# Altium project my_first_project.PrjPcb (part 1 of 3)
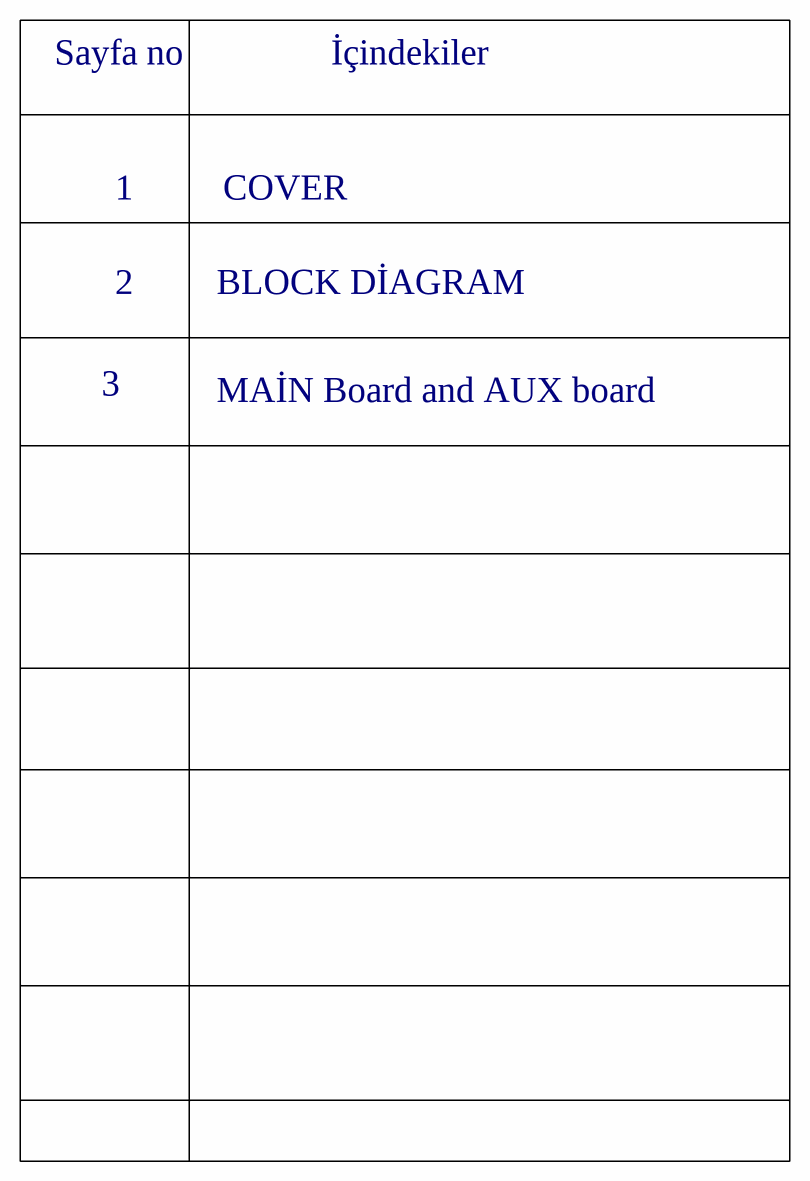
[diagram p0: project_cover.SchDoc]
5 sheets, 127 parts. Net scope: global (net labels, ports and power ports of the same name join across sheets).
Board file: myfirst_project.PcbDoc
Sheets:
  project_cover.SchDoc
  Block_Diagram.SchDoc
  SensorBoard.SchDoc
  Microcontroller.SchDoc
  POWER_Manegement.SchDoc

## Sheet project_cover.SchDoc
size A3; Engineer: Alperen ÖZKUL; DocumentNumber: 1; SheetNumber: 1; SheetTotal: 5; FIRST_PROJECT: *FIRST_PROJECT; PAGE_SİZE: *A3

### Notes on the sheet
- Sayfa no
- İçindekiler
- 1
- COVER
- 2
- BLOCK DİAGRAM
- 3
- MAİN Board and AUX board
- Engineer
- PROJECT_NUMBER
- SIZE
- TITLE
- UNIVERSITY
- DATE:
- SHEET=
- OF

## Sheet Block_Diagram.SchDoc: WİRELESS SECURİTY DETECTOR
size A3; Date: 1/10/2023; CompanyName: ZONGULDAK BÜLENT ECEVİT; Engineer: Alperen ÖZKUL; DocumentNumber: 2; SheetNumber: 2; SheetTotal: 5; FIRST_PROJECT: 1; PAGE_SİZE: *A3
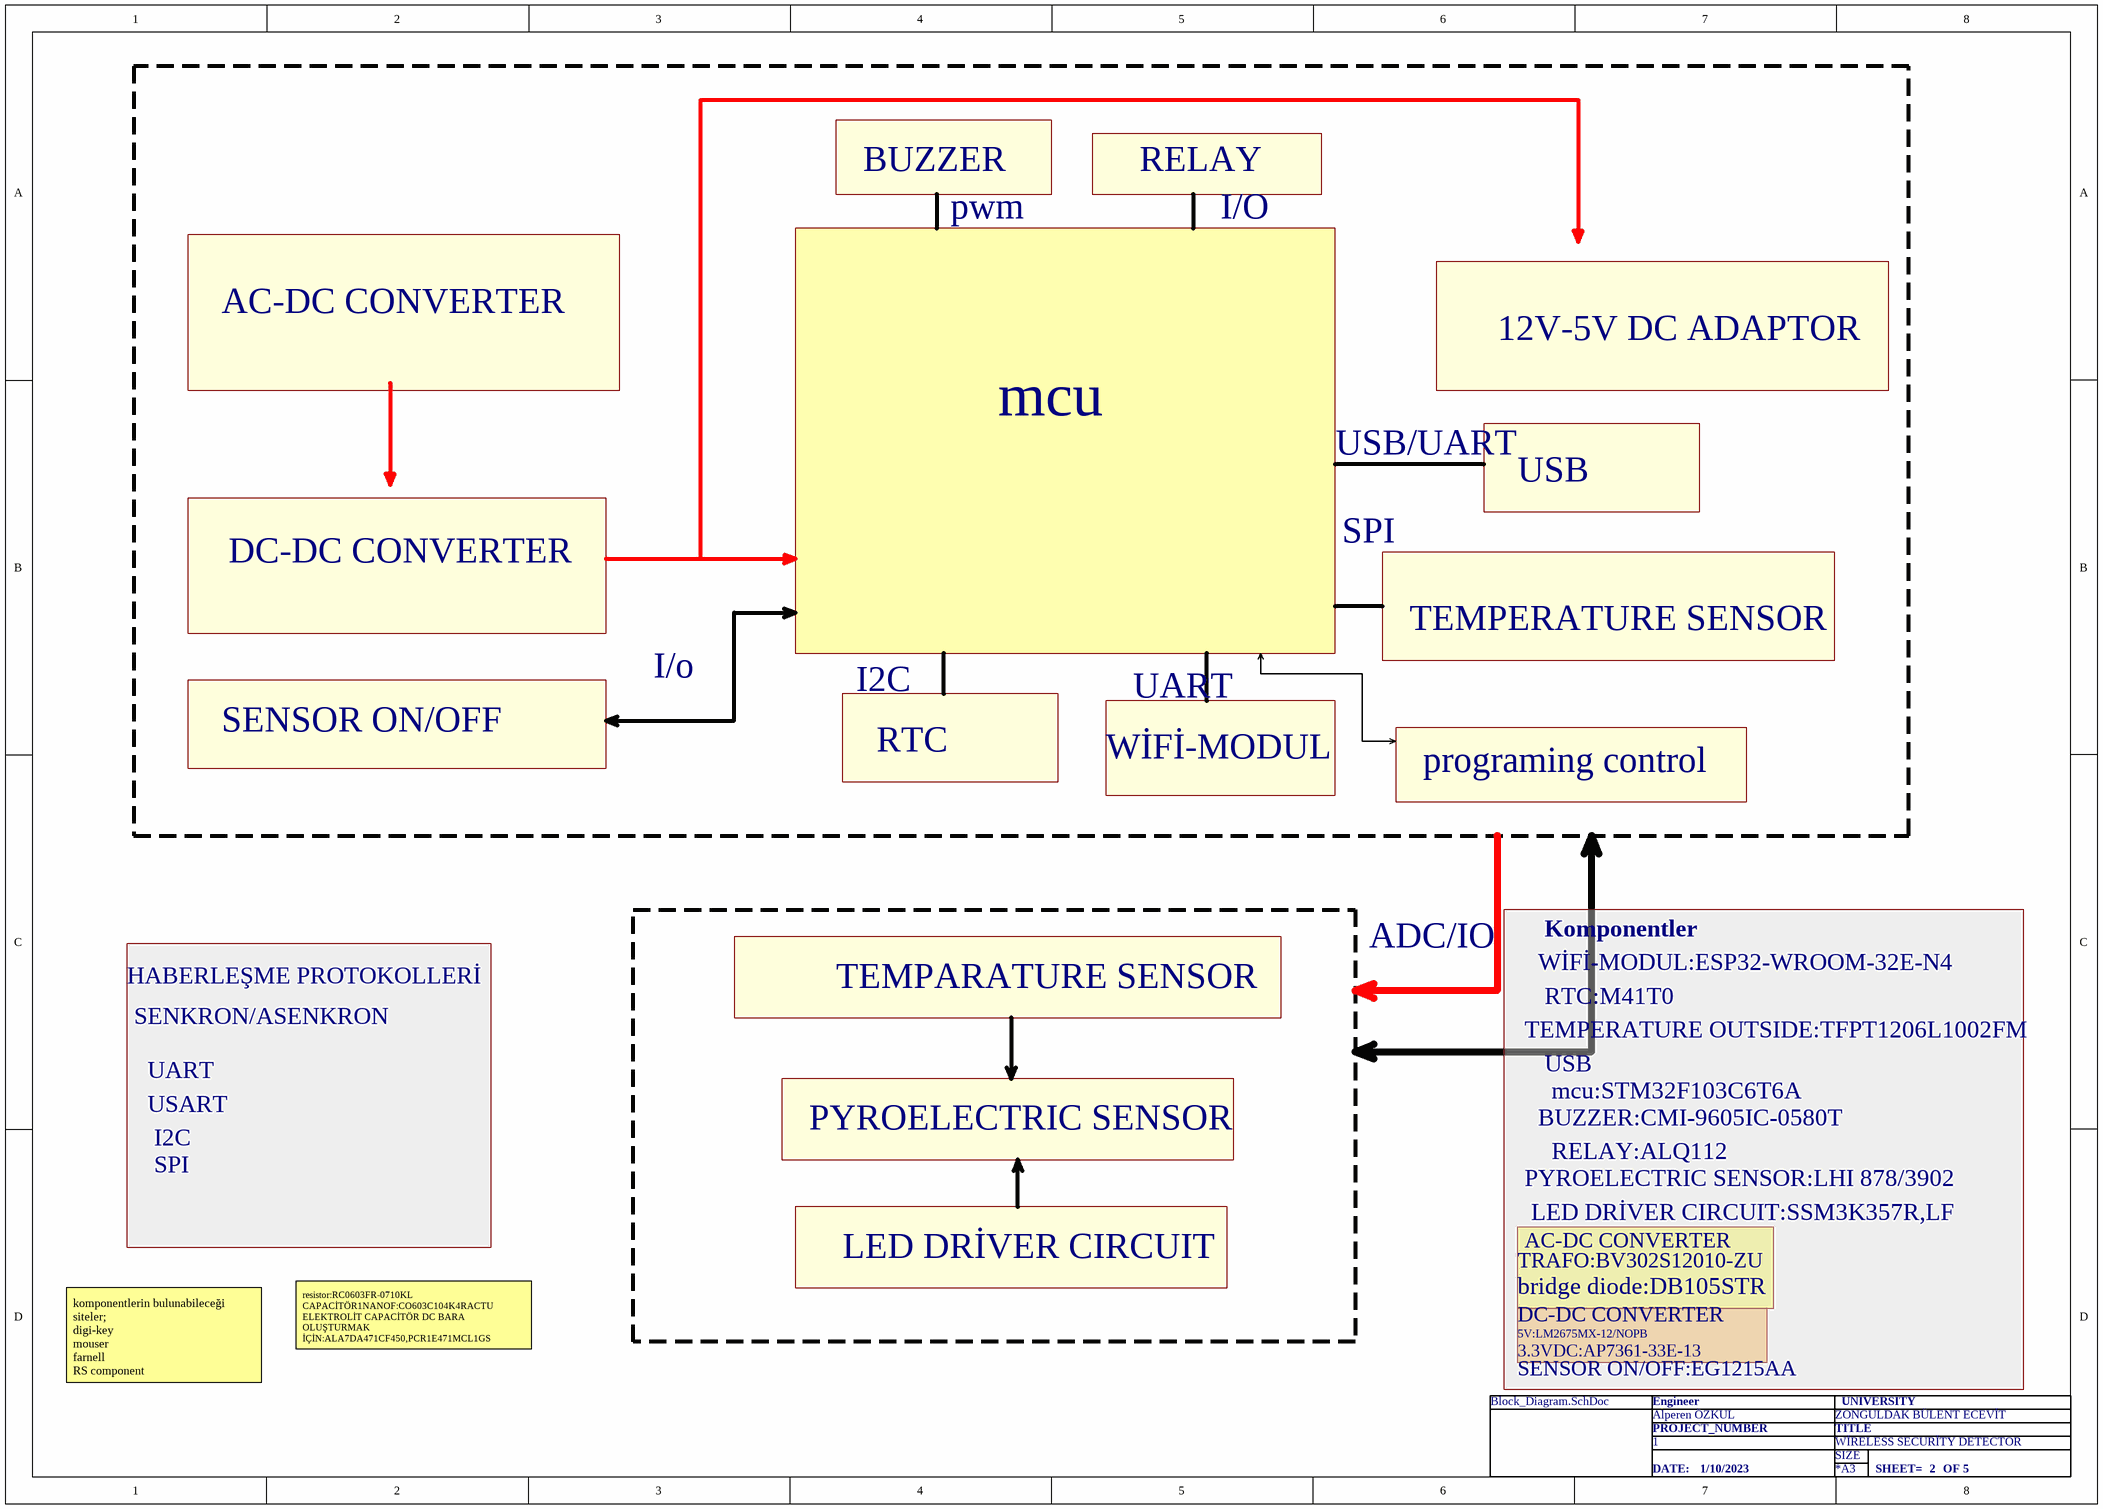
[diagram p1: Block_Diagram.SchDoc]

### Notes on the sheet
- BUZZER
- RELAY
- pwm
- I/O
- AC-DC CONVERTER
- 12V-5V DC ADAPTOR
- mcu
- USB/UART
- USB
- DC-DC CONVERTER
- SPI
- TEMPERATURE SENSOR
- I/o
- I2C
- UART
- SENSOR ON/OFF
- RTC
- WİFİ-MODUL
- programing control
- HABERLEŞME PROTOKOLLERİ
- TEMPARATURE SENSOR
- ADC/IO
- WİFİ-MODUL:ESP32-WROOM-32E-N4
- Komponentler
- SENKRON/ASENKRON
- TEMPERATURE OUTSIDE:TFPT1206L1002FM
- RTC:M41T0
- USART
- BUZZER:CMI-9605IC-0580T
- mcu:STM32F103C6T6A
- PYROELECTRIC SENSOR
- PYROELECTRIC SENSOR:LHI 878/3902
- RELAY:ALQ112
- LED DRİVER CIRCUIT
- LED DRİVER CIRCUIT:SSM3K357R,LF
- TRAFO:BV302S12010-ZU
- bridge diode:DB105STR
- komponentlerin bulunabileceği siteler;
  digi-key
  mouser
  farnell
  RS component
  LCSC
- resistor:RC0603FR-0710KL  CAPACİTÖR1NANOF:CO603C104K4RACTU                                 ELEKTROLİT CAPACİTÖR DC BARA OLUŞTURMAK İÇİN:ALA7DA471CF450,PCR1E471MCL1GS
- SENSOR ON/OFF:EG1215AA
- 5V:LM2675MX-12/NOPB
- 3.3VDC:AP7361-33E-13
- Engineer
- PROJECT_NUMBER
- SIZE
- TITLE
- UNIVERSITY
- DATE:
- SHEET=
- OF

## Sheet SensorBoard.SchDoc
size A3; SheetNumber: 5; SheetTotal: 5; FIRST_PROJECT: *FIRST_PROJECT; PAGE_SİZE: *A3
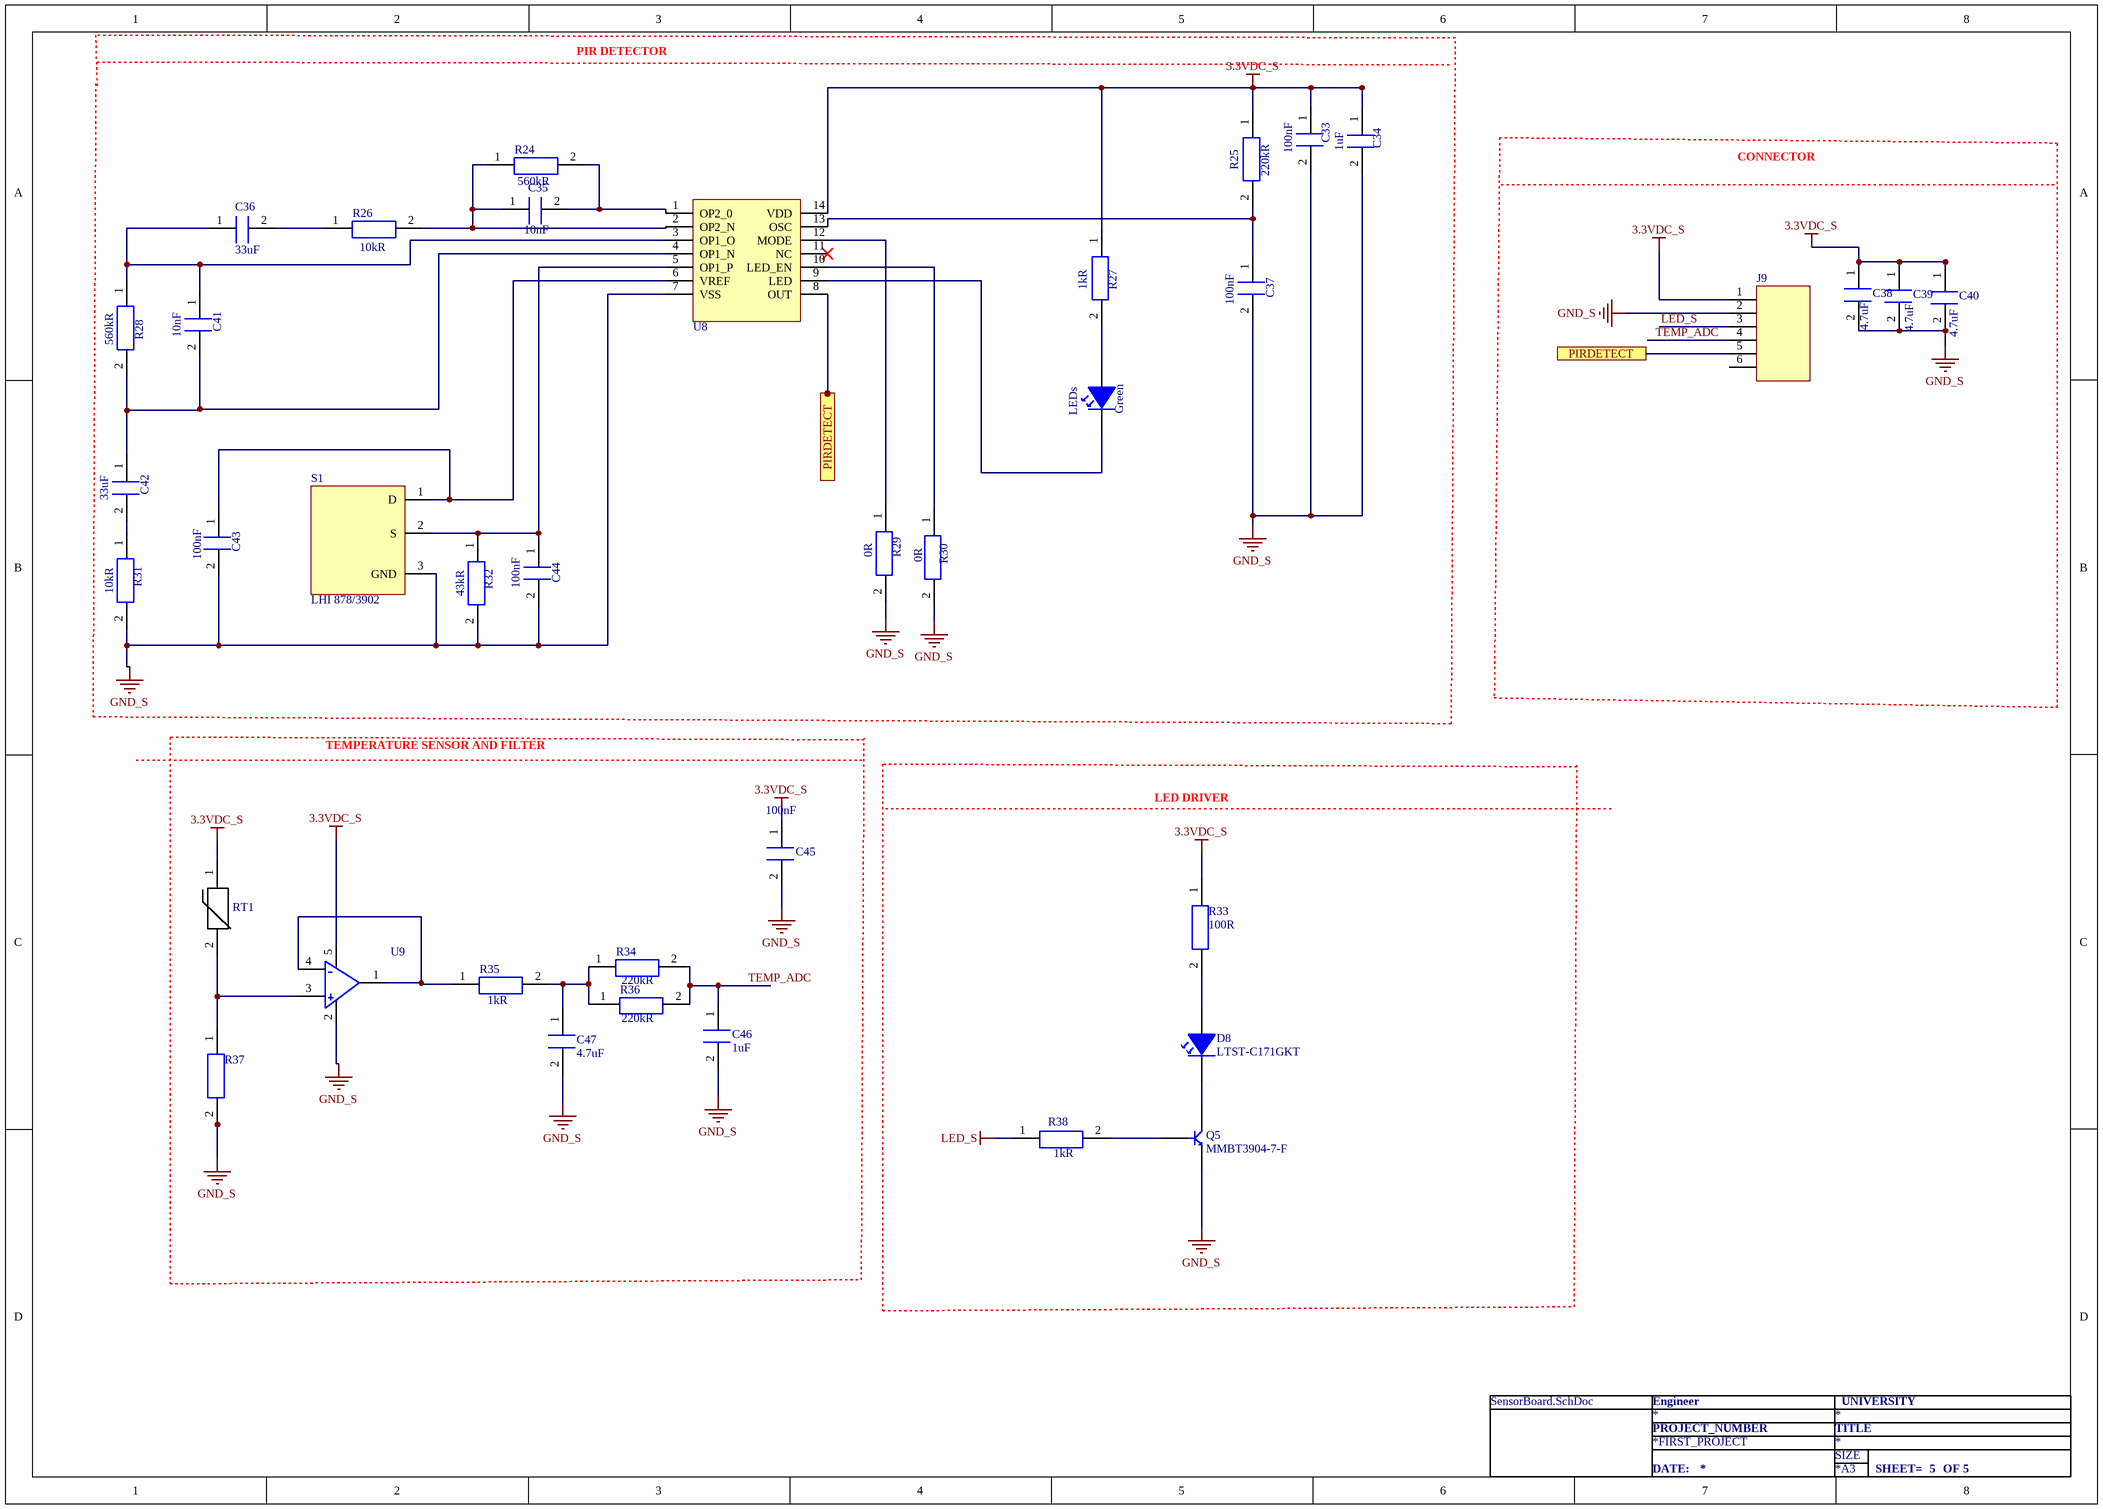
[diagram p2: SensorBoard.SchDoc]

### Parts
C33  Capacitance: 100nF  [CAP_0805]  (hidden comment: CAP CF 100NF 0805)
C34  Capacitance: 1uF  [CAP_0805]  (hidden comment: CAP CER 1UF 0805)
C35  Capacitance: 10nF  [CAP_0603]  (hidden comment: CAP CER 10nF 0603)
C36  Capacitance: 33uF  [CAP_1206]  (hidden comment: C3216X5R1E336M160AC)
C37  Capacitance: 100nF  [CAP_0805]  (hidden comment: CAP CF 100NF 0805)
C38  Capacitance: 4.7uF  [CAP_0805]  (hidden comment: CAP CER 4.7uF 0805)
C39  Capacitance: 4.7uF  [CAP_0805]  (hidden comment: CAP CER 4.7uF 0805)
C40  Capacitance: 4.7uF  [CAP_0805]  (hidden comment: CAP CER 4.7uF 0805)
C41  Capacitance: 10nF  [CAP_0603]  (hidden comment: CAP CER 10nF 0603)
C42  Capacitance: 33uF  [CAP_1206]  (hidden comment: C3216X5R1E336M160AC)
C43  Capacitance: 100nF  [CAP_0805]  (hidden comment: CAP CF 100NF 0805)
C44  Capacitance: 100nF  [CAP_0805]  (hidden comment: CAP CF 100NF 0805)
C45  Capacitance: 100nF  [CAP_0603]  (hidden comment: CAP CER 100nF 0603)
C46  Capacitance: 1uF  [CAP_0805]  (hidden comment: CAP CER 1UF 0805)
C47  Capacitance: 4.7uF  [CAP_0805]  (hidden comment: CAP CER 4.7uF 0805)
D7  Category: LEDs  Color: Green  [LED_GREEN_0805 -]  (hidden comment: LTST-C171GKT)
D8  LTST-C171GKT  [LED_GREEN_0805 -]
J9  64800611622  [64800611622]  (value not drawn)
Q5  MMBT3904-7-F  [SOT-23F]
R24  Resistance: 560kR  [RES_0603]  (hidden comment: RC0402JR-0710KL)
R25  Resistance: 220kR  [RES_0603]  (hidden comment: RC0603JR-07220KL)
R26  Resistance: 10kR  [RES_0603]  (hidden comment: RES 10KOHM%1 0603)
R27  Resistance: 1kR  [RES_0603]  (hidden comment: RES_1KOHM)
R28  Resistance: 560kR  [RES_0603]  (hidden comment: RC0402JR-0710KL)
R29  Resistance: 0R  [RES_0603]  (hidden comment: RES 0OHM 0603)
R30  Resistance: 0R  [RES_0603]  (hidden comment: RES 0OHM 0603)
R31  Resistance: 10kR  [RES_0603]  (hidden comment: RES 10KOHM%1 0603)
R32  Resistance: 43kR  [RES_0603]  (hidden comment: RC0603JR-0743KL)
R33  Resistance: 100R  [RES_0603]  (hidden comment: RES_100OHM_0603)
R34  Resistance: 220kR  [RES_0603]  (hidden comment: RC0603JR-07220KL)
R35  Resistance: 1kR  [RES_0603]  (hidden comment: RES_1KOHM)
R36  Resistance: 220kR  [RES_0603]  (hidden comment: RC0603JR-07220KL)
R37  RES 10KOHM%1 0603  [RES_0603]  (value not drawn)
R38  Resistance: 1kR  [RES_0603]  (hidden comment: RES_1KOHM)
RT1  TFPT1206L1002FM  [RES_1206]  (value not drawn)
S1  LHI 878/3902  [LHI 878/3902]
U8  NCS36000DRG  [SOIC14]  (value not drawn)
U9  OPA314AIDBVR  [SOT23_5]  (value not drawn)

### Blocks framed on the sheet
CONNECTOR: C38-C40 J9
TEMPERATURE SENSOR AND FILTER: C45-C47 R34-R37 RT1 U9
LED DRIVER: D8 Q5 R33 R38

### Ports
PIRDETECT

### Nets
3.3VDC_S: C33.1 C34.1 C38.1 C39.1 C40.1 C45.1 J9.1(VCC) R25.1 R27.1 R33.1 RT1.1 U8.14(VDD) U9.5
GND_S: C33.2 C34.2 C37.2 C38.2 C39.2 C40.2 C43.2 C44.2 C45.2 C46.2 C47.2 J9.2(RX) Q5.2(E) R29.2 R30.2 R31.2 R32.2 R37.2 S1.3(GND) U8.7(VSS) U9.2
LED_S: J9.3(TX) R38.1
TEMP_ADC: C46.1 J9.4(NC) R34.2 R36.2
NetC35_1: C35.1 R24.1 R26.2 U8.2(OP2_N)
NetC35_2: C35.2 R24.2 U8.1(OP2_0)
NetC36_1: C36.1 C41.1 R28.1 U8.3(OP1_O)
NetC36_2: C36.2 R26.1
NetC37_1: C37.1 R25.2 U8.13(OSC)
NetC41_2: C41.2 C42.1 R28.2 U8.4(OP1_N)
NetC42_2: C42.2 R31.1
NetC43_1: C43.1 S1.1(D) U8.6(VREF)
NetC44_1: C44.1 R32.1 S1.2(S) U8.5(OP1_P)
NetC47_1: C47.1 R34.1 R35.2 R36.1
NetD7_1: D7.1 U8.9(LED)
NetD7_2: D7.2 R27.2
NetD8_1: D8.1 Q5.3(C)
NetD8_2: D8.2 R33.2
NetJ9_5: J9.5(GND) U8.8(OUT) ; port PIRDETECT
NetQ5_1: Q5.1(B) R38.2
NetR29_1: R29.1 U8.12(MODE)
NetR30_1: R30.1 U8.10(LED_EN)
NetR35_1: R35.1 U9.1 U9.4
NetR37_1: R37.1 RT1.2 U9.3

Not connected (* = marked no-connect by the designer): J9 6(GND); U8 11(NC)*

### Notes on the sheet
- PIR DETECTOR
- Engineer
- PROJECT_NUMBER
- SIZE
- TITLE
- UNIVERSITY
- DATE:
- SHEET=
- OF

### Library data of the parts
C33 C37 C43 C44 = CAP CF 100NF 0805: CAP CER 0.1UF 50V X7R 0805; Manufacturer: Samsung; Manufacturer Part Number: CL21B104KBCNNNC; this part is design: alperen; Material: Ceramic; Tolerance: 10%; Supplier 1: Digi-Key; RoHS: Yes; Category: Ceramic Capacitors; Stock 1: 3449370; Pricing 1: 1=0.10000, 10=0.04400, 50=0.02400, 100=0.01960, 500=0.01404, 1000=0.01103 (USD); Mount: Surface Mount; Case/Package: 0805; Case Code (Metric): 2012; Case Code (Imperial): 0805; Contact Plating: Tin; Min Operating Temperature: -55°C; Max Operating Temperature: 125°C; Dielectric: X7R; Packaging: Tape and Reel; Voltage Rating: 50V; Voltage: 50V; Voltage Rating (DC): 50V; Series: CL; Construction: Flat; Length: 2mm; Width: 0.049inch; Height: 0.85mm; Depth: 1.25mm; Thickness: 0.037inch; Radiation Hardening: No; Lead Free: Lead Free; RoHS Compliant: Yes; ComponentLink1URL: https://datasheet.ciiva.com/25710/cl21b104kbcnnnc-25710182.pdf?src-supplier=Digi-Key; ComponentLink1Description: https://datasheet.ciiva.com/25710/cl21b104kbcnnnc-25710182.pdf?src-supplier=Digi-Key; ComponentLink2URL: https://datasheet.ciiva.com/29199/454152-da-01-en-vs-kondensator-0805-29199814.pdf?src-supplier=Conrad; ComponentLink2Description: https://datasheet.ciiva.com/29199/454152-da-01-en-vs-kondensator-0805-29199814.pdf?src-supplier=Conrad; Supplier Part Number 1: 1276-1003-1-ND
C34 C46 = CAP CER 1UF 0805: CAP CER 1UF 25V X5R 0805; Manufacturer: Murata; Manufacturer Part Number: GRM216R61E105KA12D; this part is design: alperen; Material: Ceramic; Tolerance: 10%; Supplier 1: Digi-Key; RoHS: Yes; Category: Ceramic Capacitors; Stock 1: 601950; Pricing 1: 1=0.38000, 10=0.26600, 50=0.18640, 100=0.15970, 500=0.11980, 1000=0.10116 (USD); Mount: Surface Mount; Case/Package: 0805; Number of Pins: 2; Case Code (Imperial): 0805; Case Code (Metric): 2012; Min Operating Temperature: -55°C; Max Operating Temperature: 85°C; Voltage Rating: 25V; Packaging: Tape and Reel; Dielectric: X5R; Package Quantity: 1; Termination: SMD/SMT; Voltage Rating (DC): 25V; Series: GRM; Construction: Flat; Voltage: 25V; Length: 2mm; Width: 1.25mm; Height: 0.6mm; Thickness: 0.028inch; Depth: 1.25mm; Radiation Hardening: No; RoHS Compliant: Yes; Lead Free: Lead Free; Reach SVHC Compliant: Yes; ComponentLink1URL: https://datasheet.ciiva.com/5424/product-5424880.pdf?src-supplier=Mouser; ComponentLink1Description: https://datasheet.ciiva.com/5424/product-5424880.pdf?src-supplier=Mouser; ComponentLink2URL: https://datasheet.ciiva.com/3777/337grm216r61e105ka1223-3777289.pdf?src-supplier=Arrow+Electronics; ComponentLink2Description: https://datasheet.ciiva.com/3777/337grm216r61e105ka1223-3777289.pdf?src-supplier=Arrow+Electronics; ComponentLink3URL: https://datasheet.ciiva.com/11787/0900766b80ef921d-11787891.pdf?src-supplier=Rs; ComponentLink3Description: https://datasheet.ciiva.com/11787/0900766b80ef921d-11787891.pdf?src-supplier=Rs; ComponentLink4URL: https://datasheet.ciiva.com/7719/c02e-7719049.pdf?src-supplier=Element14; ComponentLink4Description: https://datasheet.ciiva.com/7719/c02e-7719049.pdf?src-supplier=Element14; ComponentLink5URL: https://datasheet.ciiva.com/22706/1889704-22706791.pdf?src-supplier=Element14; ComponentLink5Description: https://datasheet.ciiva.com/22706/1889704-22706791.pdf?src-supplier=Element14; ComponentLink6URL: https://datasheet.ciiva.com/138/partnumbering-e-01-138518.pdf?src-supplier=Digi-Key; ComponentLink6Description: https://datasheet.ciiva.com/138/partnumbering-e-01-138518.pdf?src-supplier=Digi-Key; ComponentLink7URL: https://datasheet.ciiva.com/138/partnumbering-e-01-138517.pdf?src-supplier=Digi-Key; ComponentLink7Description: https://datasheet.ciiva.com/138/partnumbering-e-01-138517.pdf?src-supplier=Digi-Key; ComponentLink8URL: https://datasheet.ciiva.com/138/partnumbering-e-01-138519.pdf?src-supplier=Digi-Key; ComponentLink8Description: https://datasheet.ciiva.com/138/partnumbering-e-01-138519.pdf?src-supplier=Digi-Key; ComponentLink9URL: https://datasheet.ciiva.com/2989/product-2989638.pdf?src-supplier=Avnet; ComponentLink9Description: https://datasheet.ciiva.com/2989/product-2989638.pdf?src-supplier=Avnet; Supplier Part Number 1: 490-1700-1-ND
C35 C41 = CAP CER 10nF 0603: Multilayer Ceramic Capacitor, 0.01 F, 10%, X7R, 16 V, 0603 [1608 Metric] RoHS Compliant: Yes; Manufacturer: Walsin Technologies; Manufacturer Part Number: 0603B103K160CT; this part is design: alperen; Voltage Rating: 16V; Supplier 1: Digi-Key; RoHS: Yes; Category: Ceramic Capacitors; Stock 1: 152993; Pricing 1: 1=0.10000, 10=0.03300, 50=0.01820, 100=0.01480, 500=0.01060, 1000=0.00833 (USD); Case/Package: 0603; Case Code (Metric): 1608; Case Code (Imperial): 0603; Min Operating Temperature: -55°C; Max Operating Temperature: 125°C; Tolerance: 10%; Packaging: Tape and Reel; Dielectric: X7R; Voltage Rating (DC): 16V; Length: 1.6mm; Depth: 0.8mm; RoHS Compliant: Yes; ComponentLink1URL: http://www.farnell.com/datasheets/1958513.pdf?src-supplier=Farnell; ComponentLink1Description: http://www.farnell.com/datasheets/1958513.pdf?src-supplier=Farnell; ComponentLink2URL: http://www.farnell.com/datasheets/1958513.pdf?src-supplier=Element14; ComponentLink2Description: http://www.farnell.com/datasheets/1958513.pdf?src-supplier=Element14; ComponentLink3URL: http://www.passivecomponent.com/wp-content/uploads/2018/10/MLCC.pdf?src-supplier=Digi-Key; ComponentLink3Description: http://www.passivecomponent.com/wp-content/uploads/2018/10/MLCC.pdf?src-supplier=Digi-Key; Supplier Part Number 1: 1292-1384-1-ND
C36 C42 = CAP CER 33uF 1206: C Series 1206 33 uF 25 V ±20 % Tolerance X5R SMT Multilayer Ceramic Capacitor; this part is designed: alperen; Manufacturer: TDK; Voltage Rating: 25V; Tolerance: 20%; Supplier 1: Digi-Key; Manufacturer Part Number: C3216X5R1E336M160AC; RoHS: Yes; Category: Ceramic Capacitors; Stock 1: 438143; Pricing 1: 1=0.96000, 10=0.75800, 50=0.65640, 100=0.56810, 500=0.42924, 1000=0.37875 (USD); Mount: Surface Mount; Case/Package: 1206; Case Code (Metric): 3216; Case Code (Imperial): 1206; Weight: 0.000571oz; Dielectric Material: Ceramic; Min Operating Temperature: -55°C; Max Operating Temperature: 85°C; Packaging: Tape and Reel; Termination: SMD/SMT; Series: C; Package Quantity: 1; Voltage Rating (DC): 25V; Dielectric: X5R; Resistor Type: Ceramic; Length: 3.2mm; Width: 0.063inch; Depth: 1.6mm; Thickness: 1.6mm; Reach SVHC Compliant: Yes; Lead Free: Lead Free; RoHS Compliant: Yes; ComponentLink1URL: https://datasheet.ciiva.com/24216/c3216x5r1e336m160ac-265051-24216512.pdf?src-supplier=Mouser; ComponentLink1Description: https://datasheet.ciiva.com/24216/c3216x5r1e336m160ac-265051-24216512.pdf?src-supplier=Mouser; ComponentLink2URL: https://datasheet.ciiva.com/6285/tdkmlcccaprange-6285278.pdf?src-supplier=Digi-Key; ComponentLink2Description: https://datasheet.ciiva.com/6285/tdkmlcccaprange-6285278.pdf?src-supplier=Digi-Key; Supplier Part Number 1: 445-8046-1-ND
C38-C40 C47 = CAP CER 4.7uF 0805: CAP CER 4.7UF 25V X5R 0805; Manufacturer: Samsung; Manufacturer Part Number: CL21A475KAQNNNE; this part is design: alperen; Tolerance: 10%; Supplier 1: Digi-Key; RoHS: Yes; Category: Ceramic Capacitors; Stock 1: 4696474; Pricing 1: 1=0.10000, 10=0.07300, 50=0.04140, 100=0.03440, 500=0.02408, 1000=0.01994 (USD); Mount: Surface Mount; Case/Package: 0805; Case Code (Metric): 2012; Case Code (Imperial): 0805; Min Operating Temperature: -55°C; Max Operating Temperature: 85°C; Package Quantity: 1; Packaging: Tape and Reel; Voltage Rating: 25V; Dielectric: X5R; Voltage Rating (DC): 25V; Series: CL; Construction: Flat; Length: 2mm; Width: 0.049inch; Height: 1.25mm; Thickness: 0.055inch; Depth: 1.25mm; Radiation Hardening: No; Lead Free: Lead Free; RoHS Compliant: Yes; ComponentLink1URL: https://datasheet.ciiva.com/25798/cl21a475kaqnnne-25798882.pdf?src-supplier=Digi-Key; ComponentLink1Description: https://datasheet.ciiva.com/25798/cl21a475kaqnnne-25798882.pdf?src-supplier=Digi-Key; Supplier Part Number 1: 1276-1244-6-ND
C45 = CAP CER 100nF 0603: Multilayer Ceramic Capacitor, 0.1 uF, 10 V, ± 10%, X5R, 0402 [1005 Metric] %10; this part is design: alperen; Manufacturer: KEMET; Manufacturer Part Number: C0402C104K8PACTU; Voltage Rating: 10V; Dissipation Factor: 5%; Supplier 1: Digi-Key; RoHS: Yes; Category: Ceramic Capacitors; Stock 1: 2730000; Pricing 1: 10000=0.00702, 20000=0.00669, 30000=0.00635, 50000=0.00568, 100000=0.00460 (USD); Mount: Surface Mount,PCB; Case/Package: 0402; Number of Pins: 2; Case Code (Metric): 1005; Case Code (Imperial): 0402; Dielectric Material: Ceramic; Contact Plating: Tin,Matte; Min Operating Temperature: -55°C; Max Operating Temperature: 85°C; Tolerance: 10%; Voltage Rating (DC): 10V; Package Quantity: 10000; Packaging: Tape and Reel; Termination: SMD/SMT; Voltage: 10V; Series: SMD Comm X5R; Construction: Flat; Dielectric: X5R; Length: 1mm; Width: 0.5mm; Height: 0.5mm; Depth: 0.5mm; Thickness: 0.022inch; Lead Pitch: 0.3mm; Radiation Hardening: No; RoHS Compliant: Yes; Reach SVHC Compliant: Yes; Lead Free: Lead Free; Supplier Part Number 1: 399-C0402C104K8PAC7867TR-ND
D7 D8 = LED_GREEN_0805: Green 569nm LED Indication - Discrete 2.1V 0805 (2012 Metric); this part is designed: alperen; Manufacturer: Vishay Lite-On; Lens Color: Colorless; Viewing Angle: 130°; Lens Style: Diffused,Colorless,Rectangular,Clear; Luminous Intensity: 12mcd; Forward Current: 30mA; Power Rating: 100mW; Test Current: 10mA; Lens Transparency: Clear; Number of Elements: 1; Wavelength: 585nm; Reverse Voltage: 5V; Supplier 1: Digi-Key; Manufacturer Part Number: LTST-C171GKT; RoHS: Yes; Stock 1: 383798; Pricing 1: 1=0.26000, 10=0.14100, 100=0.06560, 500=0.06060, 1000=0.04747 (USD); Mount: Surface Mount; Case/Package: 0805; Number of Pins: 2; Case Code (Metric): 2012; Case Code (Imperial): 0805; Min Operating Temperature: -55°C; Max Operating Temperature: 85°C; Package Quantity: 1; Packaging: Tape and Reel; Forward Voltage: 2.1V; Illumination Color: Green; Dominant Wavelength: 569nm; Power Dissipation: 100mW; Number of LEDs: 1; Series: CHIPLED 0805; Length: 2mm; Width: 1.25mm; Height: 0.8mm; Depth: 1.25mm; Radiation Hardening: No; Lead Free: Lead Free; RoHS Compliant: Yes; ComponentLink1URL: https://datasheet.ciiva.com/2110/ltst-c171gkt-2110000.pdf?src-supplier=Digi-Key; ComponentLink1Description: https://datasheet.ciiva.com/2110/ltst-c171gkt-2110000.pdf?src-supplier=Digi-Key; ComponentLink2URL: https://datasheet.ciiva.com/12400/lite-on-ltst-c171gkt-190133-12400647.pdf?src-supplier=Mouser; ComponentLink2Description: https://datasheet.ciiva.com/12400/lite-on-ltst-c171gkt-190133-12400647.pdf?src-supplier=Mouser; ComponentLink3URL: https://datasheet.ciiva.com/11773/0900766b80dc0296-11773991.pdf?src-supplier=Rs; ComponentLink3Description: https://datasheet.ciiva.com/11773/0900766b80dc0296-11773991.pdf?src-supplier=Rs; ComponentLink4URL: https://datasheet.ciiva.com/2110/ltst-c171gkt-2110001.pdf?src-supplier=Digi-Key; ComponentLink4Description: https://datasheet.ciiva.com/2110/ltst-c171gkt-2110001.pdf?src-supplier=Digi-Key; ComponentLink5URL: https://datasheet.ciiva.com/2110/ltst-c171gkt-2110002.pdf?src-supplier=Digi-Key; ComponentLink5Description: https://datasheet.ciiva.com/2110/ltst-c171gkt-2110002.pdf?src-supplier=Digi-Key; ComponentLink6URL: https://datasheet.ciiva.com/16396/ltst-c171gkt-16396549.pdf?src-supplier=Future+Electronics; ComponentLink6Description: https://datasheet.ciiva.com/16396/ltst-c171gkt-16396549.pdf?src-supplier=Future+Electronics; Supplier Part Number 1: 160-1423-1-ND
  D8: Category: LEDs; Color: Green
J9 = 64800611622_CONN_6PİN: Conn, Header, 6POS, 1ROW, 1.5MM;; Manufacturer: Wurth Electronics; this part is designed: alperen; Supplier 1: DigiKey; Manufacturer Part Number: 64800611622; RoHS: No; Pricing 1: 1=0.42000, 50=0.40600, 100=0.38400, 250=0.36100, 500=0.33900 (USD); Supplier Part Number 1: 732-64800611622-ND
Q5 = MMBT3904-7-F: NPN Ic=200mA Vceo=40V hfe=100~300 fT=310MHz P=300mW SOT-23; this part is designed: alperen; Manufacturer: Diodes Zetex; Max Power Dissipation: 300mW; Collector Emitter Voltage (VCEO): 40V; Max Collector Current: 200mA; Collector Base Voltage (VCBO): 60V; Power Dissipation: 350mW; Frequency: 300MHz; hFE Min: 100; Number of Elements: 1; Emitter Base Voltage (VEBO): 6V; Collector Emitter Saturation Voltage: 300mV; Element Configuration: Single; Supplier 1: Digi-Key; Manufacturer Part Number: MMBT3904-7-F; RoHS: Yes; Category: BJTs; Stock 1: 7702566; Pricing 1: 1=0.13000, 10=0.11700, 100=0.06370, 500=0.03918, 1000=0.02671 (USD); Mount: Surface Mount; Case/Package: SOT-23; Number of Pins: 3; Weight: 0.000282oz; Contact Plating: Tin,Matte; Min Operating Temperature: -55°C; Max Operating Temperature: 150°C; Polarity: NPN; Packaging: Tape and Reel; Package Quantity: 3000; Transition Frequency: 300MHz; Collector Emitter Breakdown Voltage: 40V; Max Breakdown Voltage: 40V; Continuous Collector Current: 200mA; Max Frequency: 300MHz; Gain Bandwidth Product: 300MHz; Voltage Rating (DC): 40V; Series: Automotive, AEC-Q101; Collector-emitter Voltage-Max: 300mV; Length: 3.05mm; Width: 1.4mm; Height: 1mm; Radiation Hardening: No; Reach SVHC Compliant: Yes; Lead Free: Lead Free; RoHS Compliant: Yes; ComponentLink1URL: https://datasheet.ciiva.com/11201/ds30036-11201778.pdf?src-supplier=Avnet; ComponentLink1Description: https://datasheet.ciiva.com/11201/ds30036-11201778.pdf?src-supplier=Avnet; ComponentLink2URL: https://datasheet.ciiva.com/15138/getdatasheetpartid-53265-15138780.pdf?src-supplier=Verical; ComponentLink2Description: https://datasheet.ciiva.com/15138/getdatasheetpartid-53265-15138780.pdf?src-supplier=Verical; ComponentLink3URL: https://datasheet.ciiva.com/22711/1915516-22711750.pdf?src-supplier=Element14; ComponentLink3Description: https://datasheet.ciiva.com/22711/1915516-22711750.pdf?src-supplier=Element14; ComponentLink4URL: https://datasheet.ciiva.com/11198/ds30036-11198999.pdf?src-supplier=Avnet; ComponentLink4Description: https://datasheet.ciiva.com/11198/ds30036-11198999.pdf?src-supplier=Avnet; ComponentLink5URL: https://datasheet.ciiva.com/6361/ds30036-6361256.pdf?src-supplier=Digi-Key; ComponentLink5Description: https://datasheet.ciiva.com/6361/ds30036-6361256.pdf?src-supplier=Digi-Key; ComponentLink6URL: https://datasheet.ciiva.com/6361/ds30036-6361254.pdf?src-supplier=Digi-Key; ComponentLink6Description: https://datasheet.ciiva.com/6361/ds30036-6361254.pdf?src-supplier=Digi-Key; Supplier Part Number 1: MMBT3904-FDICT-ND
R24 R28 = RES 560K 0603: Res Thick Film 0603 560K Ohm 1% 0.1W(1/10W) ±100ppm/C Pad SMD T/R; this part is designed: alperen; Manufacturer: Yageo; Tolerance: 5%; Temperature Coefficient: 100ppm/°C; Power Rating: 62.5mW; Voltage Rating: 50V; Max Power Dissipation: 63mW; Working Voltage: 75V; Manufacturer Part Number: RC0402JR-0710KL; RoHS: Yes; Category: Chip SMD Resistors; Stock 1: 458042; Pricing 1: 1=0.10000, 10=0.01900, 100=0.00770, 1000=0.00345, 2500=0.00300 (USD); Case/Package: 0402; Case Code (Metric): 1005; Case Code (Imperial): 0402; Size Code: 0402; Min Operating Temperature: -55°C; Max Operating Temperature: 155°C; Packaging: Tape and Reel; Package Quantity: 1; Resistor Type: Thick Film; Number of Terminations: 2; Termination: SMD/SMT; Features: Moisture Resistant; Series: RC; Resistance Tolerance: 5%; Construction: Rectangular; Length: 0.039inch; Width: 0.02inch; Height: 0.016inch; Depth: 0.5mm; RoHS Compliant: Yes; Military Standard: Not; Lead Free: Lead Free; ComponentLink1URL: https://datasheet.ciiva.com/2452/pyu-r-int-thick-7-2452627.pdf?src-supplier=Digi-Key; ComponentLink1Description: https://datasheet.ciiva.com/2452/pyu-r-int-thick-7-2452627.pdf?src-supplier=Digi-Key; ComponentLink2URL: https://datasheet.ciiva.com/2452/pyu-r-int-thick-7-2452628.pdf?src-supplier=Digi-Key; ComponentLink2Description: https://datasheet.ciiva.com/2452/pyu-r-int-thick-7-2452628.pdf?src-supplier=Digi-Key; ComponentLink3URL: https://datasheet.ciiva.com/2452/pyu-r-int-thick-7-2452626.pdf?src-supplier=Digi-Key; ComponentLink3Description: https://datasheet.ciiva.com/2452/pyu-r-int-thick-7-2452626.pdf?src-supplier=Digi-Key; ComponentLink4URL: https://datasheet.ciiva.com/12669/pyu-rc0402-51-rohs-l-6-r-12669687.pdf?src-supplier=Mouser; ComponentLink4Description: https://datasheet.ciiva.com/12669/pyu-rc0402-51-rohs-l-6-r-12669687.pdf?src-supplier=Mouser; ComponentLink5URL: https://datasheet.ciiva.com/7850/1018594-7850136.pdf?src-supplier=Element14; ComponentLink5Description: https://datasheet.ciiva.com/7850/1018594-7850136.pdf?src-supplier=Element14; ComponentLink6URL: https://datasheet.ciiva.com/7850/1018594-7850137.pdf?src-supplier=Element14; ComponentLink6Description: https://datasheet.ciiva.com/7850/1018594-7850137.pdf?src-supplier=Element14; Stock 2: 19700; Pricing 2: 100=0.02000, 1000=0.01700, 2000=0.01500 (GBP); Number of Pins: 2; Weight: 7.1E-05oz; Voltage Rating (DC): 50V; ComponentLink7URL: https://datasheet.ciiva.com/7746/443971-7746373.pdf?src-supplier=Element14; ComponentLink7Description: https://datasheet.ciiva.com/7746/443971-7746373.pdf?src-supplier=Element14; Stock 3: 19700; Pricing 3: 1000=0.01700, 2000=0.01500 (GBP); Stock 4: 600000; Pricing 4: 5000=0.00133, 10000=0.00131, 20000=0.00127 (USD); Supplier 1: Digi-Key; Supplier Part Number 1: 311-560KHRCT-ND
R25 R34 R36 = RES 220K 0603: Res Thick Film 0603 220K Ohm 5% 0.1W(1/10W) ±100ppm/C Pad SMD T/R; this part is designed: alperen; Manufacturer: Yageo; Temperature Coefficient: 100ppm/°C; Voltage Rating (DC): 50V; Power Rating: 100mW; Supplier 1: Digi-Key; Manufacturer Part Number: RC0603JR-07220KL; RoHS: Yes; Category: Chip SMD Resistors; Stock 1: 1325078; Pricing 1: 1=0.10000, 10=0.01600, 100=0.00630, 1000=0.00284, 2500=0.00246 (USD); Case/Package: 0603; Number of Pins: 2; Case Code (Imperial): 0603; Case Code (Metric): 1608; Size Code: 0603; Min Operating Temperature: -55°C; Max Operating Temperature: 155°C; Resistor Type: Thick Film; Tolerance: 5%; Packaging: Tape and Reel; Voltage Rating: 50V; Package Quantity: 1; Termination: SMD/SMT; Number of Terminations: 2; Max Power Dissipation: 100mW; Features: Moisture Resistant; Series: RC; Construction: Rectangular; Resistance Tolerance: 5%; Length: 0.063inch; Width: 0.031inch; Height: 0.022inch; Depth: 0.8mm; Reach SVHC Compliant: Yes; Lead Free: Lead Free; RoHS Compliant: Yes; Military Standard: Not; ComponentLink1URL: https://datasheet.ciiva.com/2452/pyu-r-int-thick-7-2452924.pdf?src-supplier=Digi-Key; ComponentLink1Description: https://datasheet.ciiva.com/2452/pyu-r-int-thick-7-2452924.pdf?src-supplier=Digi-Key; ComponentLink2URL: https://datasheet.ciiva.com/2452/pyu-r-int-thick-7-2452925.pdf?src-supplier=Digi-Key; ComponentLink2Description: https://datasheet.ciiva.com/2452/pyu-r-int-thick-7-2452925.pdf?src-supplier=Digi-Key; ComponentLink3URL: https://datasheet.ciiva.com/2452/pyu-r-int-thick-7-2452923.pdf?src-supplier=Digi-Key; ComponentLink3Description: https://datasheet.ciiva.com/2452/pyu-r-int-thick-7-2452923.pdf?src-supplier=Digi-Key; Supplier Part Number 1: 311-220KGRCT-ND
R26 R31 = RES 10KOHM 0603: RES SMD 10K OHM 1% 1/10W 0603; Manufacturer: Yageo; Manufacturer Part Number: RC0603FR-0710KL; this part is design: alperen; Voltage Rating: 75V; Power Rating: 100mW; Temperature Coefficient: 100ppm/°C; Voltage Rating (DC): 50V; Supplier 1: Digi-Key; RoHS: Yes; Category: Chip SMD Resistors; Stock 1: 41977694; Pricing 1: 1=0.10000, 10=0.01900, 100=0.00770, 1000=0.00345, 2500=0.00300 (USD); Case/Package: 0603; Number of Pins: 2; Case Code (Imperial): 0603; Case Code (Metric): 1608; Size Code: 0603; Weight: 7.1E-05oz; Min Operating Temperature: -55°C; Max Operating Temperature: 155°C; Packaging: Tape and Reel; Tolerance: 1%; Termination: SMD/SMT; Resistor Type: Thick Film; Series: RC; Features: Moisture Resistant; Max Power Dissipation: 100mW; Number of Terminations: 2; Resistance Tolerance: 1%; Construction: Rectangular; Length: 1.6mm; Width: 0.8mm; Height: 0.45mm; Depth: 0.8mm; Lead Pitch: 0.3mm; Lead Free: Lead Free; RoHS Compliant: Yes; Military Standard: Not; Reach SVHC Compliant: Yes; Supplier Part Number 1: 311-10.0KHRDKR-ND
R27 R35 R38 = RES_1KOHM: Res Thin Film 0603 1K Ohm 0.1% 1/10W ±25ppm/°C Molded SMD SMD Punched Carrier T/R; this part is designed: alperen; Manufacturer: Panasonic; Manufacturer Part Number: ERA-3AEB102V; Power Rating: 100mW; Voltage Rating: 75V; Supplier 1: Digi-Key; RoHS: Yes; Category: Chip SMD Resistors; Stock 1: 5000; Pricing 1: 1=0.35000, 10=0.29900, 100=0.11670, 500=0.07056, 1000=0.04885, 2500=0.04478 (USD); Mount: Surface Mount; Case/Package: 0603; Number of Pins: 2; Case Code (Imperial): 0603; Case Code (Metric): 1608; Contact Plating: Tin; Size Code: 0603; Min Operating Temperature: -55°C; Max Operating Temperature: 155°C; Packaging: Tape and Reel; Temperature Coefficient: 25ppm/°C; Series: ERA-3A; Tolerance: 0.1%; Resistor Type: Thin Film; Number of Terminations: 2; Max Power Dissipation: 100mW; Construction: Rectangular; Features: Automotive AEC-Q200; Package Quantity: 5000; Termination: SMD/SMT; Resistance Tolerance: 0.1%; Technology: METAL FILM; Length: 1.6mm; Width: 0.8mm; Height: 0.45mm; Depth: 0.8mm; Ratings: AEC-Q200; Radiation Hardening: No; RoHS Compliant: Yes; Military Standard: Not; Reach SVHC Compliant: Yes; ComponentLink1URL: https://datasheet.ciiva.com/29183/450752-da-01-en-widerstand-0603-era-29183754.pdf?src-supplier=Conrad; ComponentLink1Description: https://datasheet.ciiva.com/29183/450752-da-01-en-widerstand-0603-era-29183754.pdf?src-supplier=Conrad; ComponentLink2URL: https://datasheet.ciiva.com/46393/1776116-46393695.pdf?src-supplier=Element14; ComponentLink2Description: https://datasheet.ciiva.com/46393/1776116-46393695.pdf?src-supplier=Element14; ComponentLink3URL: https://datasheet.ciiva.com/5734/aoa0000ce26-5734524.pdf?src-supplier=Farnell; ComponentLink3Description: https://datasheet.ciiva.com/5734/aoa0000ce26-5734524.pdf?src-supplier=Farnell; ComponentLink4URL: https://datasheet.ciiva.com/46422/1776116-46422455.pdf?src-supplier=Element14; ComponentLink4Description: https://datasheet.ciiva.com/46422/1776116-46422455.pdf?src-supplier=Element14; ComponentLink5URL: https://datasheet.ciiva.com/48530/era-eng-tds-48530582.pdf?src-supplier=Distrelec; ComponentLink5Description: https://datasheet.ciiva.com/48530/era-eng-tds-48530582.pdf?src-supplier=Distrelec; ComponentLink6URL: https://datasheet.ciiva.com/46422/485442-46422519.pdf?src-supplier=Element14; ComponentLink6Description: https://datasheet.ciiva.com/46422/485442-46422519.pdf?src-supplier=Element14; ComponentLink7URL: https://datasheet.ciiva.com/5734/485442-5734525.pdf?src-supplier=Farnell; ComponentLink7Description: https://datasheet.ciiva.com/5734/485442-5734525.pdf?src-supplier=Farnell; ComponentLink8URL: https://datasheet.ciiva.com/28531/485442-28531944.pdf?src-supplier=Element14; ComponentLink8Description: https://datasheet.ciiva.com/28531/485442-28531944.pdf?src-supplier=Element14; ComponentLink9URL: https://datasheet.ciiva.com/24071/aoa0000ce26-197354-24071510.pdf?src-supplier=Mouser; ComponentLink9Description: https://datasheet.ciiva.com/24071/aoa0000ce26-197354-24071510.pdf?src-supplier=Mouser; ComponentLink10URL: https://datasheet.ciiva.com/16781/70068849-16781703.pdf?src-supplier=Allied+Electronics; ComponentLink10Description: https://datasheet.ciiva.com/16781/70068849-16781703.pdf?src-supplier=Allied+Electronics; ComponentLink11URL: https://datasheet.ciiva.com/16725/70068849-16725038.pdf?src-supplier=Allied+Electronics; ComponentLink11Description: https://datasheet.ciiva.com/16725/70068849-16725038.pdf?src-supplier=Allied+Electronics; ComponentLink12URL: https://datasheet.ciiva.com/9198/aoa0000ce26-9198972.pdf?src-supplier=Avnet; ComponentLink12Description: https://datasheet.ciiva.com/9198/aoa0000ce26-9198972.pdf?src-supplier=Avnet; ComponentLink13URL: https://datasheet.ciiva.com/16426/aoa0000ce26-16426809.pdf?src-supplier=Future+Electronics; ComponentLink13Description: https://datasheet.ciiva.com/16426/aoa0000ce26-16426809.pdf?src-supplier=Future+Electronics; Supplier Part Number 1: P1.0KDBCT-ND
R29 R30 = RES 0OHM 0603: RES SMD 0 OHM JUMPER 1/10W 0603; Manufacturer: Yageo; Manufacturer Part Number: RC0603JR-070RL; this part is design: alperen; Tolerance: 1%; Power Rating: 100mW; Voltage Rating (DC): 50V; Temperature Coefficient: 200ppm/°C; Resistance Tolerance: 5%; Supplier 1: Digi-Key; RoHS: Yes; Category: Chip SMD Resistors; Stock 1: 15243640; Pricing 1: 1=0.10000, 10=0.01600, 25=0.01120, 50=0.00860, 100=0.00630, 250=0.00480, 500=0.00386, 1000=0.00284 (USD); Case/Package: 0603; Number of Pins: 2; Contact Plating: Tin,Matte; Case Code (Imperial): 0603; Case Code (Metric): 1608; Size Code: 0603; Min Operating Temperature: -55°C; Max Operating Temperature: 155°C; Resistor Type: Thick Film; Packaging: Tape and Reel; Termination: SMD/SMT; Series: RC; Technology: THICK FILM; Package Quantity: 5000; Voltage Rating: 50V; Features: Moisture Resistant; Max Power Dissipation: 100mW; Number of Terminations: 2; Construction: Rectangular; Length: 1.6mm; Width: 0.8mm; Height: 0.45mm; Depth: 0.8mm; Radiation Hardening: No; Lead Free: Lead Free; RoHS Compliant: Yes; Military Standard: Not; Supplier Part Number 1: 311-0.0GRCT-ND
R32 = RES 43K 0603: Res Thick Film 0603 43K Ohm 5% 0.1W(1/10W) ±100ppm/°C Pad SMD T/R; this part is designed: alperen; Manufacturer: Yageo; Voltage Rating: 75V; Power Rating: 100mW; Voltage Rating (DC): 50V; Supplier 1: Digi-Key; Manufacturer Part Number: RC0603JR-0743KL; RoHS: Yes; Category: Chip SMD Resistors; Stock 1: 123730; Pricing 1: 1=0.10000, 10=0.01600, 100=0.00630, 1000=0.00284, 2500=0.00246 (USD); Case/Package: 0603; Case Code (Imperial): 0603; Case Code (Metric): 1608; Weight: 7.1E-05oz; Min Operating Temperature: -55°C; Max Operating Temperature: 155°C; Tolerance: 5%; Packaging: Tape and Reel; Package Quantity: 1; Termination: SMD/SMT; Resistor Type: Thick Film; Number of Terminations: 2; Temperature Coefficient: 100ppm/°C; Max Power Dissipation: 100mW; Working Voltage: 75V; Features: Moisture Resistant; Series: RC; Construction: Rectangular; Technology: THICK FILM; Length: 1.6mm; Width: 0.8mm; Height: 0.022inch; Depth: 0.8mm; Military Standard: Not; Lead Free: Lead Free; RoHS Compliant: Yes; ComponentLink1URL: https://datasheet.ciiva.com/2453/pyu-r-int-thick-7-2453053.pdf?src-supplier=Digi-Key; ComponentLink1Description: https://datasheet.ciiva.com/2453/pyu-r-int-thick-7-2453053.pdf?src-supplier=Digi-Key; ComponentLink2URL: https://datasheet.ciiva.com/2453/pyu-r-int-thick-7-2453054.pdf?src-supplier=Digi-Key; ComponentLink2Description: https://datasheet.ciiva.com/2453/pyu-r-int-thick-7-2453054.pdf?src-supplier=Digi-Key; ComponentLink3URL: https://datasheet.ciiva.com/2453/pyu-r-int-thick-7-2453052.pdf?src-supplier=Digi-Key; ComponentLink3Description: https://datasheet.ciiva.com/2453/pyu-r-int-thick-7-2453052.pdf?src-supplier=Digi-Key; Supplier Part Number 1: 311-43KGRCT-ND
R33 = RES_100OHM_0603: Res Thick Film 0603 100 Ohm 1% 1/10W ±100ppm/°C Molded SMD Paper T/R; this part is design: alperen; Manufacturer: Vishay Dale; Manufacturer Part Number: CRCW0603100RFKEA; Max Power Dissipation: 100mW; Voltage Rating: 75V; Supplier 1: Digi-Key; RoHS: Yes; Category: Chip SMD Resistors; Stock 1: 9146; Pricing 1: 1=0.10000, 10=0.03800, 100=0.01560, 1000=0.00701, 2500=0.00608 (USD); Mount: Surface Mount; Case/Package: 0603; Number of Pins: 2; Case Code (Metric): 1608; Case Code (Imperial): 0603; Contact Plating: Tin; Size Code: 0603; Weight: 7.1E-05oz; Min Operating Temperature: -55°C; Max Operating Temperature: 155°C; Packaging: Tape and Reel; Temperature Coefficient: 100ppm/°C; Tolerance: 1%; Series: CRCW; Resistor Type: Thick Film; Number of Terminations: 2; Power Rating: 100mW; Features: Automotive AEC-Q200; Construction: Rectangular; Termination: SMD/SMT; Package Quantity: 10; Voltage Rating (DC): 75V; Resistance Tolerance: 1%; Length: 1.55mm; Width: 0.033inch; Height: 0.02inch; Depth: 0.85mm; Ratings: AEC-Q200; Radiation Hardening: No; RoHS Compliant: Yes; Military Standard: Not; Lead Free: Lead Free; ComponentLink1URL: https://datasheet.ciiva.com/22666/1720486-22666207.pdf?src-supplier=Element14; ComponentLink1Description: https://datasheet.ciiva.com/22666/1720486-22666207.pdf?src-supplier=Element14; ComponentLink2URL: https://datasheet.ciiva.com/26316/fld-crcw-e3-data-en-26316566.pdf?src-supplier=Distrelec; ComponentLink2Description: https://datasheet.ciiva.com/26316/fld-crcw-e3-data-en-26316566.pdf?src-supplier=Distrelec; ComponentLink3URL: https://datasheet.ciiva.com/22673/1697337-22673066.pdf?src-supplier=Element14; ComponentLink3Description: https://datasheet.ciiva.com/22673/1697337-22673066.pdf?src-supplier=Element14; ComponentLink4URL: https://datasheet.ciiva.com/2465/dcrcwe3-2465544.pdf?src-supplier=Digi-Key; ComponentLink4Description: https://datasheet.ciiva.com/2465/dcrcwe3-2465544.pdf?src-supplier=Digi-Key; ComponentLink5URL: https://datasheet.ciiva.com/2465/dcrcwe3-2465545.pdf?src-supplier=Digi-Key; ComponentLink5Description: https://datasheet.ciiva.com/2465/dcrcwe3-2465545.pdf?src-supplier=Digi-Key; ComponentLink6URL: https://datasheet.ciiva.com/2465/dcrcwe3-2465543.pdf?src-supplier=Digi-Key; ComponentLink6Description: https://datasheet.ciiva.com/2465/dcrcwe3-2465543.pdf?src-supplier=Digi-Key; ComponentLink7URL: https://datasheet.ciiva.com/16721/70201119-16721486.pdf?src-supplier=Allied+Electronics; ComponentLink7Description: https://datasheet.ciiva.com/16721/70201119-16721486.pdf?src-supplier=Allied+Electronics; ComponentLink8URL: https://datasheet.ciiva.com/16787/70201119-16787964.pdf?src-supplier=Allied+Electronics; ComponentLink8Description: https://datasheet.ciiva.com/16787/70201119-16787964.pdf?src-supplier=Allied+Electronics; ComponentLink9URL: https://datasheet.ciiva.com/5550/dcrcwe3-109170-5550286.pdf?src-supplier=Mouser; ComponentLink9Description: https://datasheet.ciiva.com/5550/dcrcwe3-109170-5550286.pdf?src-supplier=Mouser; ComponentLink10URL: https://datasheet.ciiva.com/16199/dcrcwe3-16199102.pdf?src-supplier=Future+Electronics; ComponentLink10Description: https://datasheet.ciiva.com/16199/dcrcwe3-16199102.pdf?src-supplier=Future+Electronics; Supplier Part Number 1: 541-100HCT-ND
R37 = RES 10KOHM 0603: RES SMD 10K OHM 1% 1/10W 0603; Manufacturer: Yageo; Manufacturer Part Number: RC0603FR-0710KL; this part is design: alperen; Voltage Rating: 75V; Resistance: 10kR; Power Rating: 100mW; Temperature Coefficient: 100ppm/°C; Voltage Rating (DC): 50V; Supplier 1: Digi-Key; RoHS: Yes; Category: Chip SMD Resistors; Stock 1: 41977694; Pricing 1: 1=0.10000, 10=0.01900, 100=0.00770, 1000=0.00345, 2500=0.00300 (USD); Case/Package: 0603; Number of Pins: 2; Case Code (Imperial): 0603; Case Code (Metric): 1608; Size Code: 0603; Weight: 7.1E-05oz; Min Operating Temperature: -55°C; Max Operating Temperature: 155°C; Packaging: Tape and Reel; Tolerance: 1%; Termination: SMD/SMT; Resistor Type: Thick Film; Series: RC; Features: Moisture Resistant; Max Power Dissipation: 100mW; Number of Terminations: 2; Resistance Tolerance: 1%; Construction: Rectangular; Length: 1.6mm; Width: 0.8mm; Height: 0.45mm; Depth: 0.8mm; Lead Pitch: 0.3mm; Lead Free: Lead Free; RoHS Compliant: Yes; Military Standard: Not; Reach SVHC Compliant: Yes; Supplier Part Number 1: 311-10.0KHRDKR-ND
RT1 = TFPT1206L1002FM: Thermistor PTC 10K Ohm 1% 2-Pin 1206 Surface Mount Solder Pad T/R Automotive; Manufacturer: Vishay Dale; Manufacturer Part Number: TFPT1206L1002FV; this part is design: alperen; Resistance: 10kR; Max Supply Voltage: 50V; Max Power Dissipation: 125mW; Supplier 1: Digi-Key; RoHS: Yes; Category: Thermistors; Stock 1: 21933; Pricing 1: 1=2.12000, 5=2.04400, 10=1.66000, 25=1.43040, 50=1.23900, 100=1.12400, 500=0.94520 (USD); Mount: Surface Mount; Case/Package: 1206; Number of Pins: 2; Case Code (Metric): 3216; Case Code (Imperial): 1206; Min Operating Temperature: -55°C; Max Operating Temperature: 150°C; Packaging: Tape and Reel; Tolerance: 1%; Package Quantity: 1000; Termination: SMD/SMT; Voltage: 50V; Operating Supply Voltage: 50V; Series: TFPT; Resistance Tolerance: 1%; Length: 3.2mm; Width: 1.6mm; Height: 0.55mm; Depth: 1.6mm; Radiation Hardening: No; Lead Free: Lead Free; RoHS Compliant: Yes; ComponentLink1URL: https://datasheet.ciiva.com/16328/tfpt-16328725.pdf?src-supplier=Future+Electronics; ComponentLink1Description: https://datasheet.ciiva.com/16328/tfpt-16328725.pdf?src-supplier=Future+Electronics; ComponentLink2URL: https://datasheet.ciiva.com/2851/tfpt-2851542.pdf?src-supplier=Digi-Key; ComponentLink2Description: https://datasheet.ciiva.com/2851/tfpt-2851542.pdf?src-supplier=Digi-Key; ComponentLink3URL: https://datasheet.ciiva.com/2851/tfpt-2851543.pdf?src-supplier=Digi-Key; ComponentLink3Description: https://datasheet.ciiva.com/2851/tfpt-2851543.pdf?src-supplier=Digi-Key; ComponentLink4URL: https://datasheet.ciiva.com/2851/tfpt-2851544.pdf?src-supplier=Digi-Key; ComponentLink4Description: https://datasheet.ciiva.com/2851/tfpt-2851544.pdf?src-supplier=Digi-Key; ComponentLink5URL: https://datasheet.ciiva.com/48474/tfpt-48474456.pdf?src-supplier=Avnet; ComponentLink5Description: https://datasheet.ciiva.com/48474/tfpt-48474456.pdf?src-supplier=Avnet; ComponentLink6URL: https://datasheet.ciiva.com/7652/1748925-7652366.pdf?src-supplier=Element14; ComponentLink6Description: https://datasheet.ciiva.com/7652/1748925-7652366.pdf?src-supplier=Element14; ComponentLink7URL: https://datasheet.ciiva.com/46391/1748925-46391327.pdf?src-supplier=Element14; ComponentLink7Description: https://datasheet.ciiva.com/46391/1748925-46391327.pdf?src-supplier=Element14; Supplier Part Number 1: 541-1189-1-ND
S1 = LHI 878/3902: Sensor PIR (Passive Infrared) TO-205AA, TO-5-3 Metal Can; Manufacturer: Excelitas; this part is design: alperen; Max Supply Voltage: 12; Min Supply Voltage: 2; Supplier 1: Newark; Manufacturer Part Number: LHI878/3902; RoHS: No; Type: Pyro Detector; ComponentLink1Description: DATASHEET; ComponentLink1URL: https://www.excelitas.com/product/pyd-1388-pyd-1398-dual-element-pyros; Case/Parameter: LHI 878/3902; Supplier Part Number 1: 61T6571
U8 = NCS36000: NCS36000 Series Single 5.75V Passive Infrared Detector Controller (PIR) -SOIC-14; this part is designed: alperen; Manufacturer: ON Semiconductor; Operating Supply Current: 50uA; Quiescent Current: 20uA; Min Supply Voltage: 3V; Output Type: Digital; Supplier 1: Digi-Key; Manufacturer Part Number: NCS36000DRG; RoHS: Yes; Category: Amplifiers - Op Amps, Buffer, Instrumentation; Pricing 1: 1=1.31000, 10=1.16700, 25=1.10760, 100=0.90990, 250=0.85052, 500=0.75162, 1000=0.59339 (USD); Case/Package: SOIC; Number of Pins: 14; Min Operating Temperature: -40°C; Max Operating Temperature: 85°C; Package Quantity: 3000; Packaging: Tape and Reel; Max Supply Voltage: 5.75V; Series: -; Input Type: DIGITAL; Length: 8.75mm; Width: 4mm; Height: 1.5mm; Radiation Hardening: No; Reach SVHC Compliant: Yes; Lead Free: Lead Free; Halogen Free: Halogen Free; RoHS Compliant: Yes; ComponentLink1URL: https://datasheet.ciiva.com/1781/ncs36000-d-1781637.pdf?src-supplier=Digi-Key; ComponentLink1Description: https://datasheet.ciiva.com/1781/ncs36000-d-1781637.pdf?src-supplier=Digi-Key; ComponentLink2URL: https://datasheet.ciiva.com/4763/ncs36000-d-89569-4763639.pdf?src-supplier=Mouser; ComponentLink2Description: https://datasheet.ciiva.com/4763/ncs36000-d-89569-4763639.pdf?src-supplier=Mouser; ComponentLink3URL: https://datasheet.ciiva.com/1781/ncs36000-d-1781638.pdf?src-supplier=Digi-Key; ComponentLink3Description: https://datasheet.ciiva.com/1781/ncs36000-d-1781638.pdf?src-supplier=Digi-Key; ComponentLink4URL: https://datasheet.ciiva.com/1781/ncs36000-d-1781639.pdf?src-supplier=Digi-Key; ComponentLink4Description: https://datasheet.ciiva.com/1781/ncs36000-d-1781639.pdf?src-supplier=Digi-Key; ComponentLink5URL: https://datasheet.ciiva.com/2965/ncs36000-d-2965212.pdf?src-supplier=Avnet; ComponentLink5Description: https://datasheet.ciiva.com/2965/ncs36000-d-2965212.pdf?src-supplier=Avnet; ComponentLink6URL: https://datasheet.ciiva.com/2966/ncs36000-d-2966525.pdf?src-supplier=Avnet; ComponentLink6Description: https://datasheet.ciiva.com/2966/ncs36000-d-2966525.pdf?src-supplier=Avnet; Supplier Part Number 1: NCS36000DRGOSDKR-ND
U9 = OPA 314: IC OPAMP GP 3MHZ RRO SOT23-5; this part is designed: alperen; Manufacturer: Texas Instruments; Min Supply Voltage: 1.8V; Max Supply Voltage: 5.5V; Min Dual Supply Voltage: 900mV; Max Dual Supply Voltage: 2.75V; Voltage Gain: 128dB; Common Mode Rejection Ratio: 75dB; Output Current: 20mA; Nominal Supply Current: 150uA; Number of Channels: 1; Slew Rate: 1.5V/µs; Max I/O Voltage: 2.5mV; Input Bias Current: 10pA; Power Supply Rejection Ratio (PSRR): 78dB; Amplifier Type: GENERAL PURPOSE; Supplier 1: Digi-Key; Manufacturer Part Number: OPA314AIDBVR; RoHS: Yes; Category: Amplifiers - Op Amps, Buffer, Instrumentation; Pricing 1: 1=1.21000, 10=1.08500, 25=1.03000, 100=0.84600, 250=0.79080, 500=0.69886, 1000=0.55173 (USD); Case/Package: SOT-23-5; Number of Pins: 5; Contact Plating: Gold; Min Operating Temperature: -40°C; Max Operating Temperature: 125°C; Gain Bandwidth Product: 3MHz; Package Quantity: 1; Packaging: Tape and Reel; Unity Gain Bandwidth Product: 3MHz; Nominal Gain Bandwidth Product: 3MHz; Input Offset Voltage (Vos): 2.5mV; Operating Supply Current: 150uA; Number of Circuits: 1; Output Current per Channel: 20mA; Number of Elements: 1; Supply Current: 150uA; Series: -; Technology: CMOS; Radiation Hardening: No; Lead Free: Lead Free; RoHS Compliant: Yes; ComponentLink1URL: https://datasheet.ciiva.com/29638/opa314-29638827.pdf?src-supplier=Digi-Key; ComponentLink1Description: https://datasheet.ciiva.com/29638/opa314-29638827.pdf?src-supplier=Digi-Key; ComponentLink2URL: https://datasheet.ciiva.com/14462/opa2314-14462006.pdf?src-supplier=Avnet; ComponentLink2Description: https://datasheet.ciiva.com/14462/opa2314-14462006.pdf?src-supplier=Avnet; ComponentLink3URL: https://datasheet.ciiva.com/14456/opa2314-14456281.pdf?src-supplier=Avnet; ComponentLink3Description: https://datasheet.ciiva.com/14456/opa2314-14456281.pdf?src-supplier=Avnet; Supplier Part Number 1: 296-36699-1-ND